# EasyEDA Pro project ProPrj_transverter-front-end_2026-04-14.epro, schematic transverter-filter-board
Board Name: transverter-filter-board; Create Date: 2026-04-02; Page Name: filter-board; Project Name: transverter-front-end; Schematic Name: transverter-filter-board; Update Date: 2026-04-09; Add into BOM: yes; Company: Your Company; Convert to PCB: yes; Date: 2026-03-07; Draw By: dbenhart; REV: 1.0; Sheet: 1/1; spicePre: .
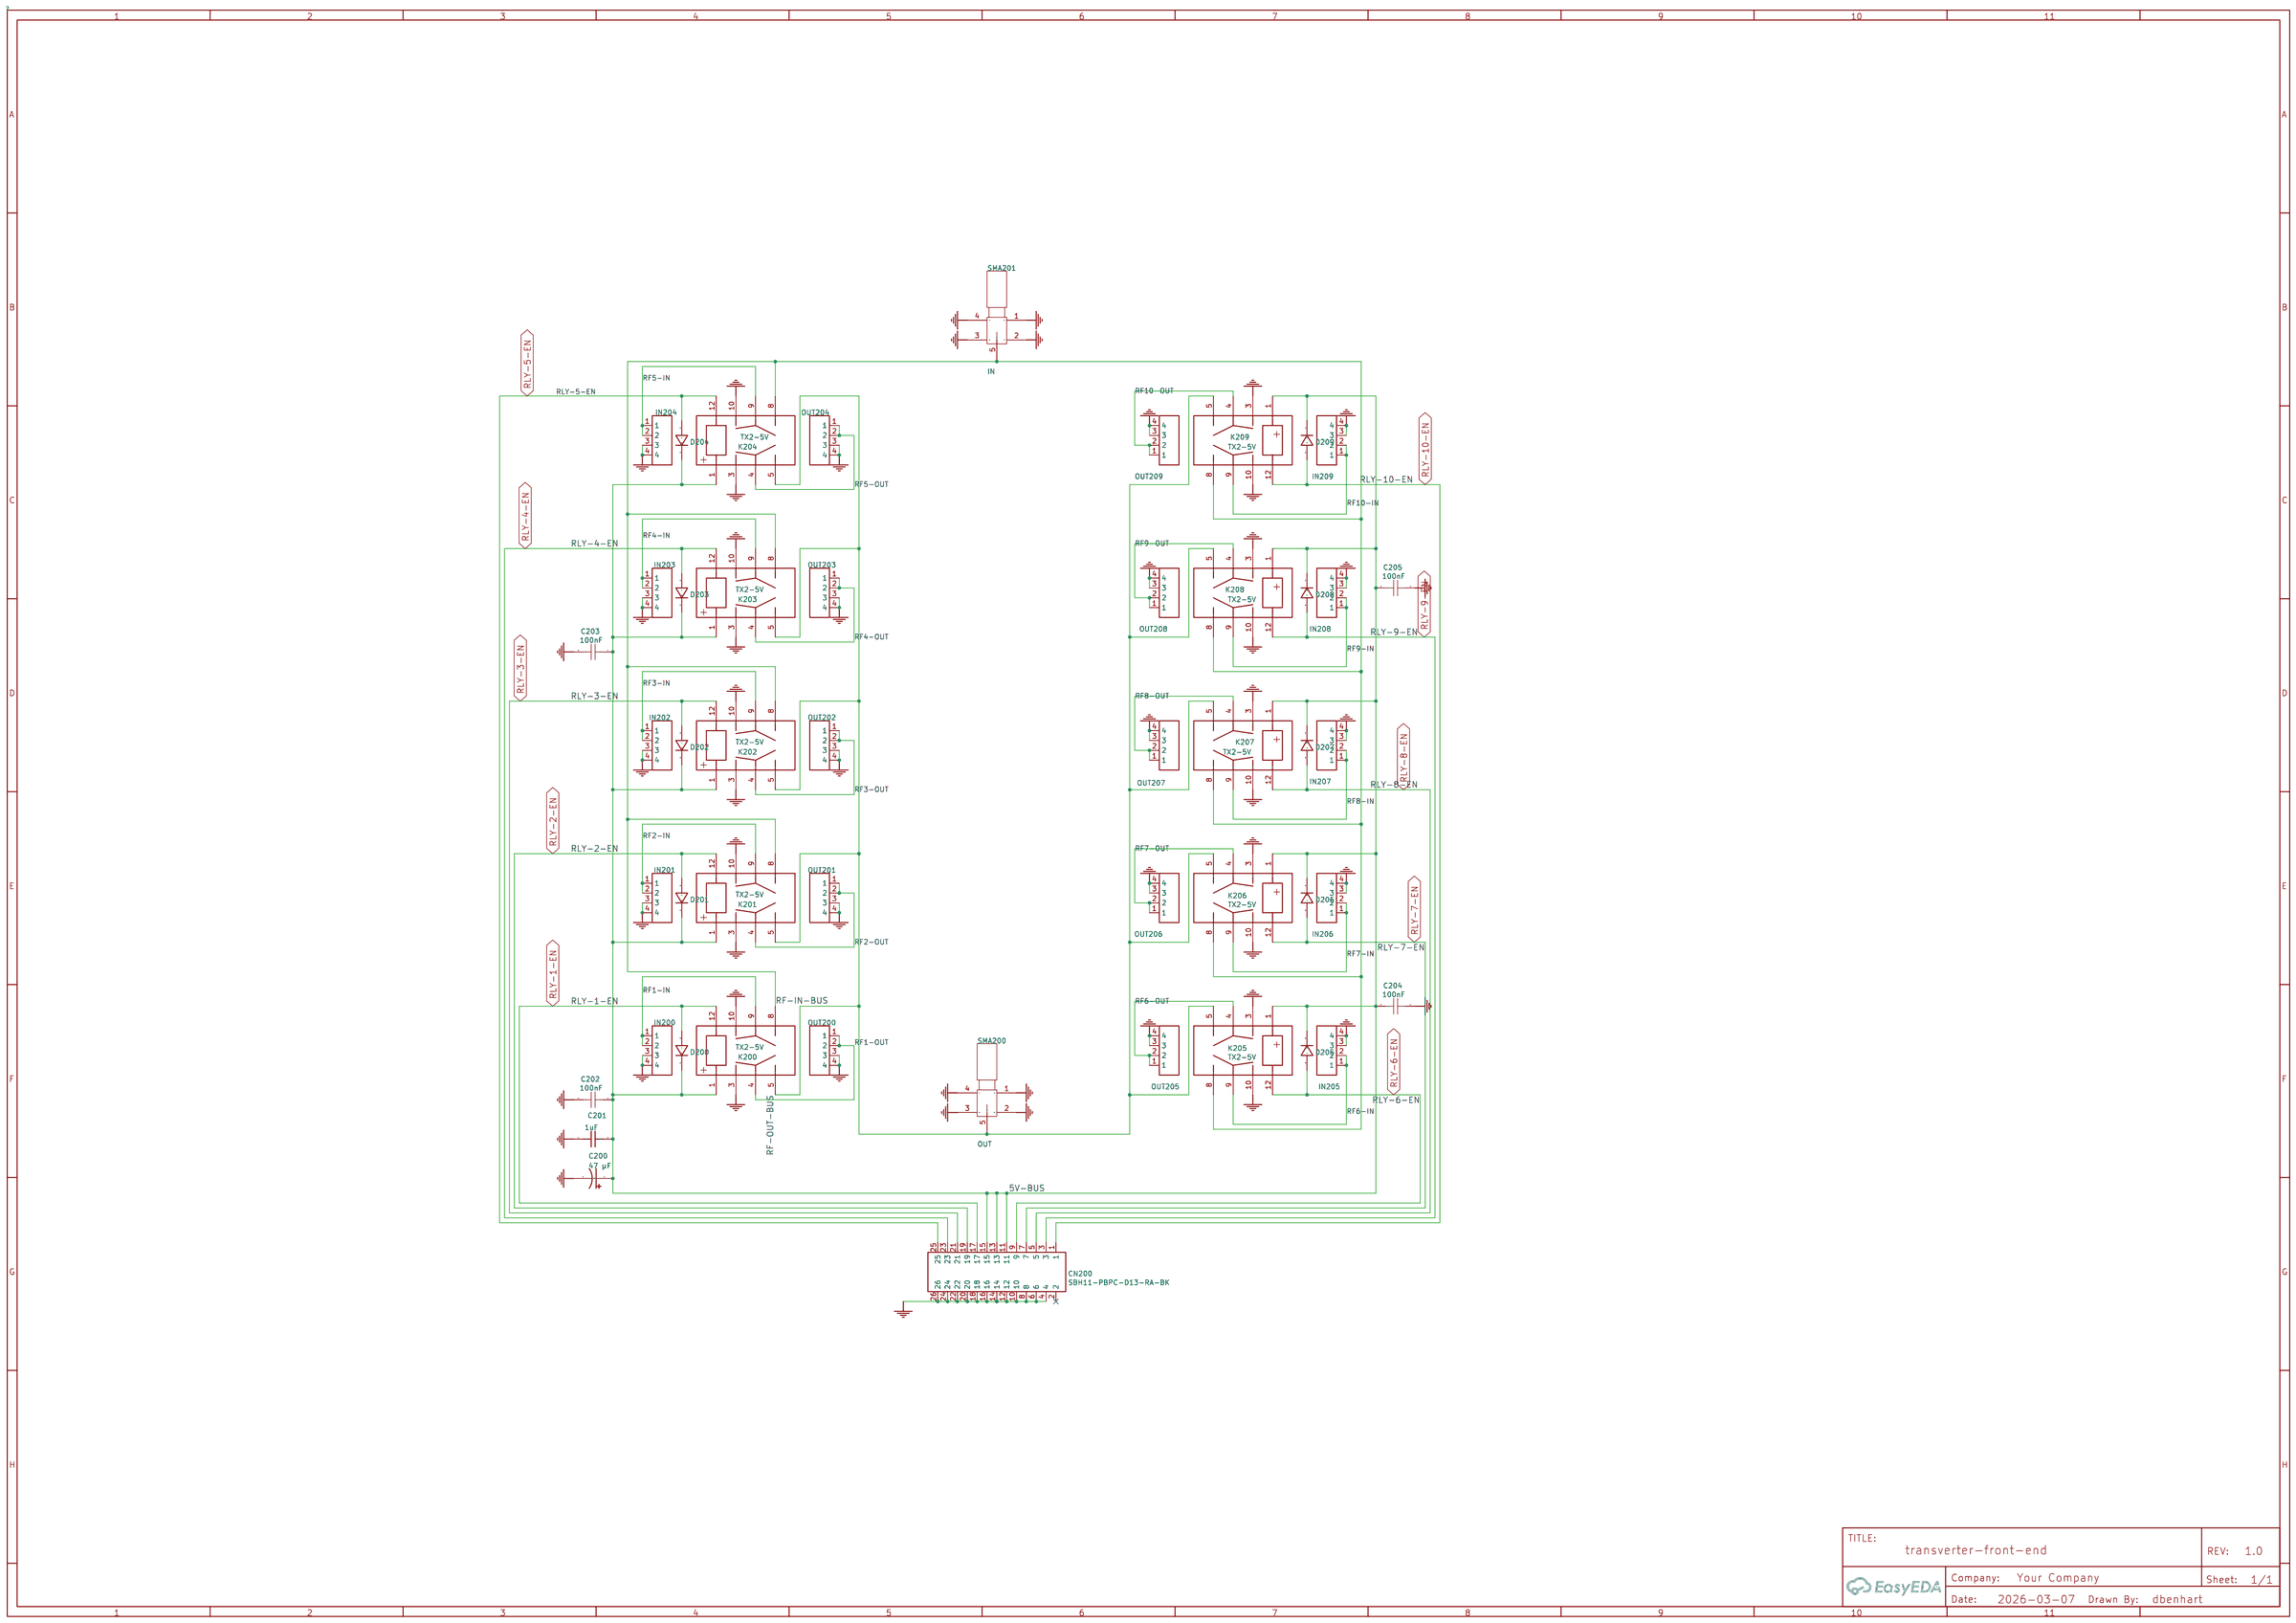
[diagram p3: schematic sheet]

## Parts
C200  47 µF  [CAP-TH_BD8.0-P3.50-D0.6-FD]
C201  1uF  [C0805]
C202  100nF  [C0805]
C203  100nF  [C0805]
C204  100nF  [C0805]
C205  100nF  [C0805]
CN200  SBH11-PBPC-D13-RA-BK  [IDC-TH_26P-P2.54-H-M-R2-C13-W8.8]
D200  1N4148W-7-F  [SOD-123_L2.7-W1.6-LS3.7-RD-1]
D201  1N4148W-7-F  [SOD-123_L2.7-W1.6-LS3.7-RD-1]
D202  1N4148W-7-F  [SOD-123_L2.7-W1.6-LS3.7-RD-1]
D203  1N4148W-7-F  [SOD-123_L2.7-W1.6-LS3.7-RD-1]
D204  1N4148W-7-F  [SOD-123_L2.7-W1.6-LS3.7-RD-1]
D205  1N4148W-7-F  [SOD-123_L2.7-W1.6-LS3.7-RD-1]
D206  1N4148W-7-F  [SOD-123_L2.7-W1.6-LS3.7-RD-1]
D207  1N4148W-7-F  [SOD-123_L2.7-W1.6-LS3.7-RD-1]
D208  1N4148W-7-F  [SOD-123_L2.7-W1.6-LS3.7-RD-1]
D209  1N4148W-7-F  [SOD-123_L2.7-W1.6-LS3.7-RD-1]
IN200  PPPC041LFBN-RC  [HDR-TH_4P-P2.54-V-F]  (no BOM)
IN201  PPPC041LFBN-RC  [HDR-TH_4P-P2.54-V-F]  (no BOM)
IN202  PPPC041LFBN-RC  [HDR-TH_4P-P2.54-V-F]  (no BOM)
IN203  PPPC041LFBN-RC  [HDR-TH_4P-P2.54-V-F]  (no BOM)
IN204  PPPC041LFBN-RC  [HDR-TH_4P-P2.54-V-F]  (no BOM)
IN205  PPPC041LFBN-RC  [HDR-TH_4P-P2.54-V-F]  (no BOM)
IN206  PPPC041LFBN-RC  [HDR-TH_4P-P2.54-V-F]  (no BOM)
IN207  PPPC041LFBN-RC  [HDR-TH_4P-P2.54-V-F]  (no BOM)
IN208  PPPC041LFBN-RC  [HDR-TH_4P-P2.54-V-F]  (no BOM)
IN209  PPPC041LFBN-RC  [HDR-TH_4P-P2.54-V-F]  (no BOM)
K200  TX2-5V  [RELAY-TH_TX2-3V]
K201  TX2-5V  [RELAY-TH_TX2-3V]
K202  TX2-5V  [RELAY-TH_TX2-3V]
K203  TX2-5V  [RELAY-TH_TX2-3V]
K204  TX2-5V  [RELAY-TH_TX2-3V]
K205  TX2-5V  [RELAY-TH_TX2-3V]
K206  TX2-5V  [RELAY-TH_TX2-3V]
K207  TX2-5V  [RELAY-TH_TX2-3V]
K208  TX2-5V  [RELAY-TH_TX2-3V]
K209  TX2-5V  [RELAY-TH_TX2-3V]
OUT200  PPPC041LFBN-RC  [HDR-TH_4P-P2.54-V-F]  (no BOM)
OUT201  PPPC041LFBN-RC  [HDR-TH_4P-P2.54-V-F]  (no BOM)
OUT202  PPPC041LFBN-RC  [HDR-TH_4P-P2.54-V-F]  (no BOM)
OUT203  PPPC041LFBN-RC  [HDR-TH_4P-P2.54-V-F]  (no BOM)
OUT204  PPPC041LFBN-RC  [HDR-TH_4P-P2.54-V-F]  (no BOM)
OUT205  PPPC041LFBN-RC  [HDR-TH_4P-P2.54-V-F]  (no BOM)
OUT206  PPPC041LFBN-RC  [HDR-TH_4P-P2.54-V-F]  (no BOM)
OUT207  PPPC041LFBN-RC  [HDR-TH_4P-P2.54-V-F]  (no BOM)
OUT208  PPPC041LFBN-RC  [HDR-TH_4P-P2.54-V-F]  (no BOM)
OUT209  PPPC041LFBN-RC  [HDR-TH_4P-P2.54-V-F]  (no BOM)
SMA200  OUT  [ANT-TH_SMA-J-P-H-RA-TH1]
SMA201  IN  [ANT-TH_SMA-J-P-H-RA-TH1]

## Library data of the parts
C200 = EEH-AZA1H470B: Supplier: Digi-Key; Supplier Part: 10-EEH-AZA1H470BCT-ND; Manufacturer: PANASONIC(松下); JLCPCB Part Class: Extended Part; Contributor: lcsc; spicePre: C; spiceSymbolName: EEH-AZA1H680B
C201 = 1uF: Supplier Part: 478-KGM21ER71E105KUCT-ND; Supplier: Digi-Key; Manufacturer Part: KGM21ER71E105KU; voltage: 25; Manufacturer: KYOCERA AVX; nameAlias: Value(F); Contributor: LCEDA_Lib; spicePre: C; spiceSymbolName: C_0603_US; Package Display: No
C202-C205 = KGM21NR71E104KT: Capacitance:100nF Tolerance:±10% Tolerance:±10% Voltage Rating:25V Temperature Coefficient:X7R; LCSC Part Name: 100nF ±10% 25V; Supplier Part: C20220997; Manufacturer: Kyocera AVX; JLCPCB Part Class: Extended Part; Supplier: LCSC; Tolerance: ±10%; Voltage Rating: 25V; Temperature Coefficient: X7R
CN200 = SBH11-PBPC-D13-RA-BK: Supplier: LCSC; Supplier Part: C17260960; Manufacturer: Sullins; JLCPCB Part Class: Extended Part; Contributor: lcsc; spicePre: C
D200-D209 = 1N4148W-7-F: Supplier: LCSC; Manufacturer: DIODES(美台); Supplier Part: C83528; JLCPCB Part Class: Extended Part; spicePre: D
IN200-IN209 OUT200-OUT209 = PPPC041LFBN-RC: Supplier: LCSC; Supplier Part: C6629381; Manufacturer: Sullins; JLCPCB Part Class: Extended Part; Contributor: lcsc; spicePre: U
K200-K209 = TX2-5V: Supplier: LCSC; Supplier Part: C192257; Manufacturer: PANASONIC(松下); JLCPCB Part Class: Extended Part; Contributor: LCSC; spicePre: K
SMA200 SMA201 = SMA-J-P-H-RA-TH1_C6488932: Connector Type:Board Side Number of Ports:1 Frequency:20GHz RF Series:SMA Impedance:50Ω Rated Voltage (Max):335V Operating Temperature Range:-65℃~+125℃ Operating Temperature Range:-65℃~+125℃; LCSC Part Name: SMA; Supplier Part: C6488932; Manufacturer: SAMTEC; Manufacturer Part: SMA-J-P-H-RA-TH1; Supplier Footprint: 插件; JLCPCB Part Class: Extended Part; Datasheet: https://item.szlcsc.com/datasheet/SMA-J-P-H-RA-TH1/7442116.html; Supplier: LCSC; Connector Type: Board Side; Number of Ports: 1; RF Series: SMA; Impedance: 50Ω; Rated Voltage (Max): 335V; Operating Temperature Range: -65℃~+125℃

## Nets
5V-BUS: C200.1 C201.2 C202.1 C203.1 C204.2 C205.2 CN200.11 CN200.13 CN200.15 D200.1(C) D201.1(C) D202.1(C) D203.1(C) D204.1(C) D205.1(C) D206.1(C) D207.1(C) D208.1(C) D209.1(C) K200.1 K201.1 K202.1 K203.1 K204.1 K205.1 K206.1 K207.1 K208.1 K209.1
GND: C200.2 C201.1 C202.2 C203.2 C204.1 C205.1 CN200.4 CN200.6 CN200.8 CN200.10 CN200.12 CN200.14 CN200.16 CN200.18 CN200.20 CN200.22 CN200.24 CN200.26 IN200.3 IN200.4 IN201.3 IN201.4 IN202.3 IN202.4 IN203.3 IN203.4 IN204.3 IN204.4 IN205.3 IN205.4 IN206.3 IN206.4 IN207.3 IN207.4 IN208.3 IN208.4 IN209.3 IN209.4 K200.3 K200.10 K201.3 K201.10 K202.3 K202.10 K203.3 K203.10 K204.3 K204.10 K205.3 K205.10 K206.3 K206.10 K207.3 K207.10 K208.3 K208.10 K209.3 K209.10 OUT200.3 OUT200.4 OUT201.3 OUT201.4 OUT202.3 OUT202.4 OUT203.3 OUT203.4 OUT204.3 OUT204.4 OUT205.3 OUT205.4 OUT206.3 OUT206.4 OUT207.3 OUT207.4 OUT208.3 OUT208.4 OUT209.3 OUT209.4 SMA200.1 SMA200.2 SMA200.3 SMA200.4 SMA201.1 SMA201.2 SMA201.3 SMA201.4
RF1-IN: IN200.1 IN200.2 K200.9
RF1-OUT: K200.4 OUT200.1 OUT200.2
RF2-IN: IN201.1 IN201.2 K201.9
RF2-OUT: K201.4 OUT201.1 OUT201.2
RF3-IN: IN202.1 IN202.2 K202.9
RF3-OUT: K202.4 OUT202.1 OUT202.2
RF4-IN: IN203.1 IN203.2 K203.9
RF4-OUT: K203.4 OUT203.1 OUT203.2
RF5-IN: IN204.1 IN204.2 K204.9
RF5-OUT: K204.4 OUT204.1 OUT204.2
RF6-IN: IN205.1 IN205.2 K205.9
RF6-OUT: K205.4 OUT205.1 OUT205.2
RF7-IN: IN206.1 IN206.2 K206.9
RF7-OUT: K206.4 OUT206.1 OUT206.2
RF8-IN: IN207.1 IN207.2 K207.9
RF8-OUT: K207.4 OUT207.1 OUT207.2
RF9-IN: IN208.1 IN208.2 K208.9
RF9-OUT: K208.4 OUT208.1 OUT208.2
RF10-IN: IN209.1 IN209.2 K209.9
RF10-OUT: K209.4 OUT209.1 OUT209.2
RF-IN-BUS: K200.8 K201.8 K202.8 K203.8 K204.8 K205.8 K206.8 K207.8 K208.8 K209.8 SMA201.5
RF-OUT-BUS: K200.5 K201.5 K202.5 K203.5 K204.5 K205.5 K206.5 K207.5 K208.5 K209.5 SMA200.5
RLY-1-EN: CN200.17 D200.2(A) K200.12
RLY-2-EN: CN200.19 D201.2(A) K201.12
RLY-3-EN: CN200.21 D202.2(A) K202.12
RLY-4-EN: CN200.23 D203.2(A) K203.12
RLY-5-EN: CN200.25 D204.2(A) K204.12
RLY-6-EN: CN200.9 D205.2(A) K205.12
RLY-7-EN: CN200.7 D206.2(A) K206.12
RLY-8-EN: CN200.5 D207.2(A) K207.12
RLY-9-EN: CN200.3 D208.2(A) K208.12
RLY-10-EN: CN200.1 D209.2(A) K209.12

Not connected (* = marked no-connect by the designer): CN200 2*
